# Altium schematic sheet BANK_1.SchDoc
size A4
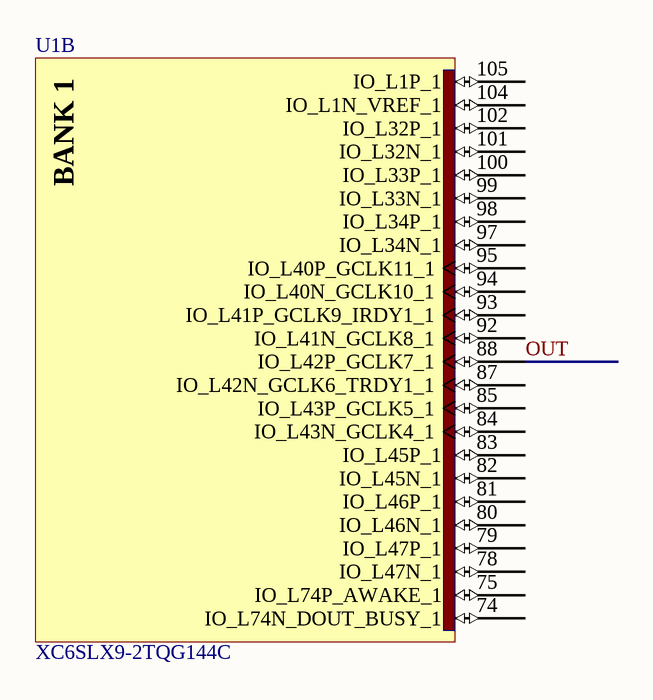
[diagram p0: BANK_1.SchDoc]

## Parts
U1  XC6SLX9-2TQG144C  [TQG144_N]  (part B of 7)

## Nets
OUT: U1.88(IO_L42P_GCLK7_1)

Not connected (* = marked no-connect by the designer): U1 74(IO_L74N_DOUT_BUSY_1) 75(IO_L74P_AWAKE_1) 78(IO_L47N_1) 79(IO_L47P_1) 80(IO_L46N_1) 81(IO_L46P_1) 82(IO_L45N_1) 83(IO_L45P_1) 84(IO_L43N_GCLK4_1) 85(IO_L43P_GCLK5_1) 87(IO_L42N_GCLK6_TRDY1_1) 92(IO_L41N_GCLK8_1) 93(IO_L41P_GCLK9_IRDY1_1) 94(IO_L40N_GCLK10_1) 95(IO_L40P_GCLK11_1) 97(IO_L34N_1) 98(IO_L34P_1) 99(IO_L33N_1) 100(IO_L33P_1) 101(IO_L32N_1) 102(IO_L32P_1) 104(IO_L1N_VREF_1) 105(IO_L1P_1)

## Notes on the sheet
- (in symbol XC6SLX9-2TQG144C, part B) BANK 1

## Library data of the parts
U1 = XC6SLX9-2TQG144C: Spartan-6 LX 1.2V FPGA, 102 User I/Os, 144-Pin TQFP (0.5mm Pitch), Speed Grade 2, Commercial Grade, Pb-Free; DatasheetVersion: ver1.6, Nov-2010; PackageVersion: ver1.2, Jun-2004; PackageReference: TQG144; PackageDescription: 144-Pin Thin Quad Flat Pack (TQG144) - Pb-Free; Code_JEDEC: MS-026-BFB; ComponentLink1Description: Manufacturer URL; ComponentLink1URL: http://www.xilinx.com/; ComponentLink2Description: Spartan-6 Datasheet; ComponentLink2URL: http://www.xilinx.com/support/documentation/data_sheets/ds160.pdf; ComponentLink3Description: Spartan-6 Documents; ComponentLink3URL: http://www.xilinx.com/support/documentation/spartan-6.htm